# EAGLE design badge2 (EAGLE 9.3.1)
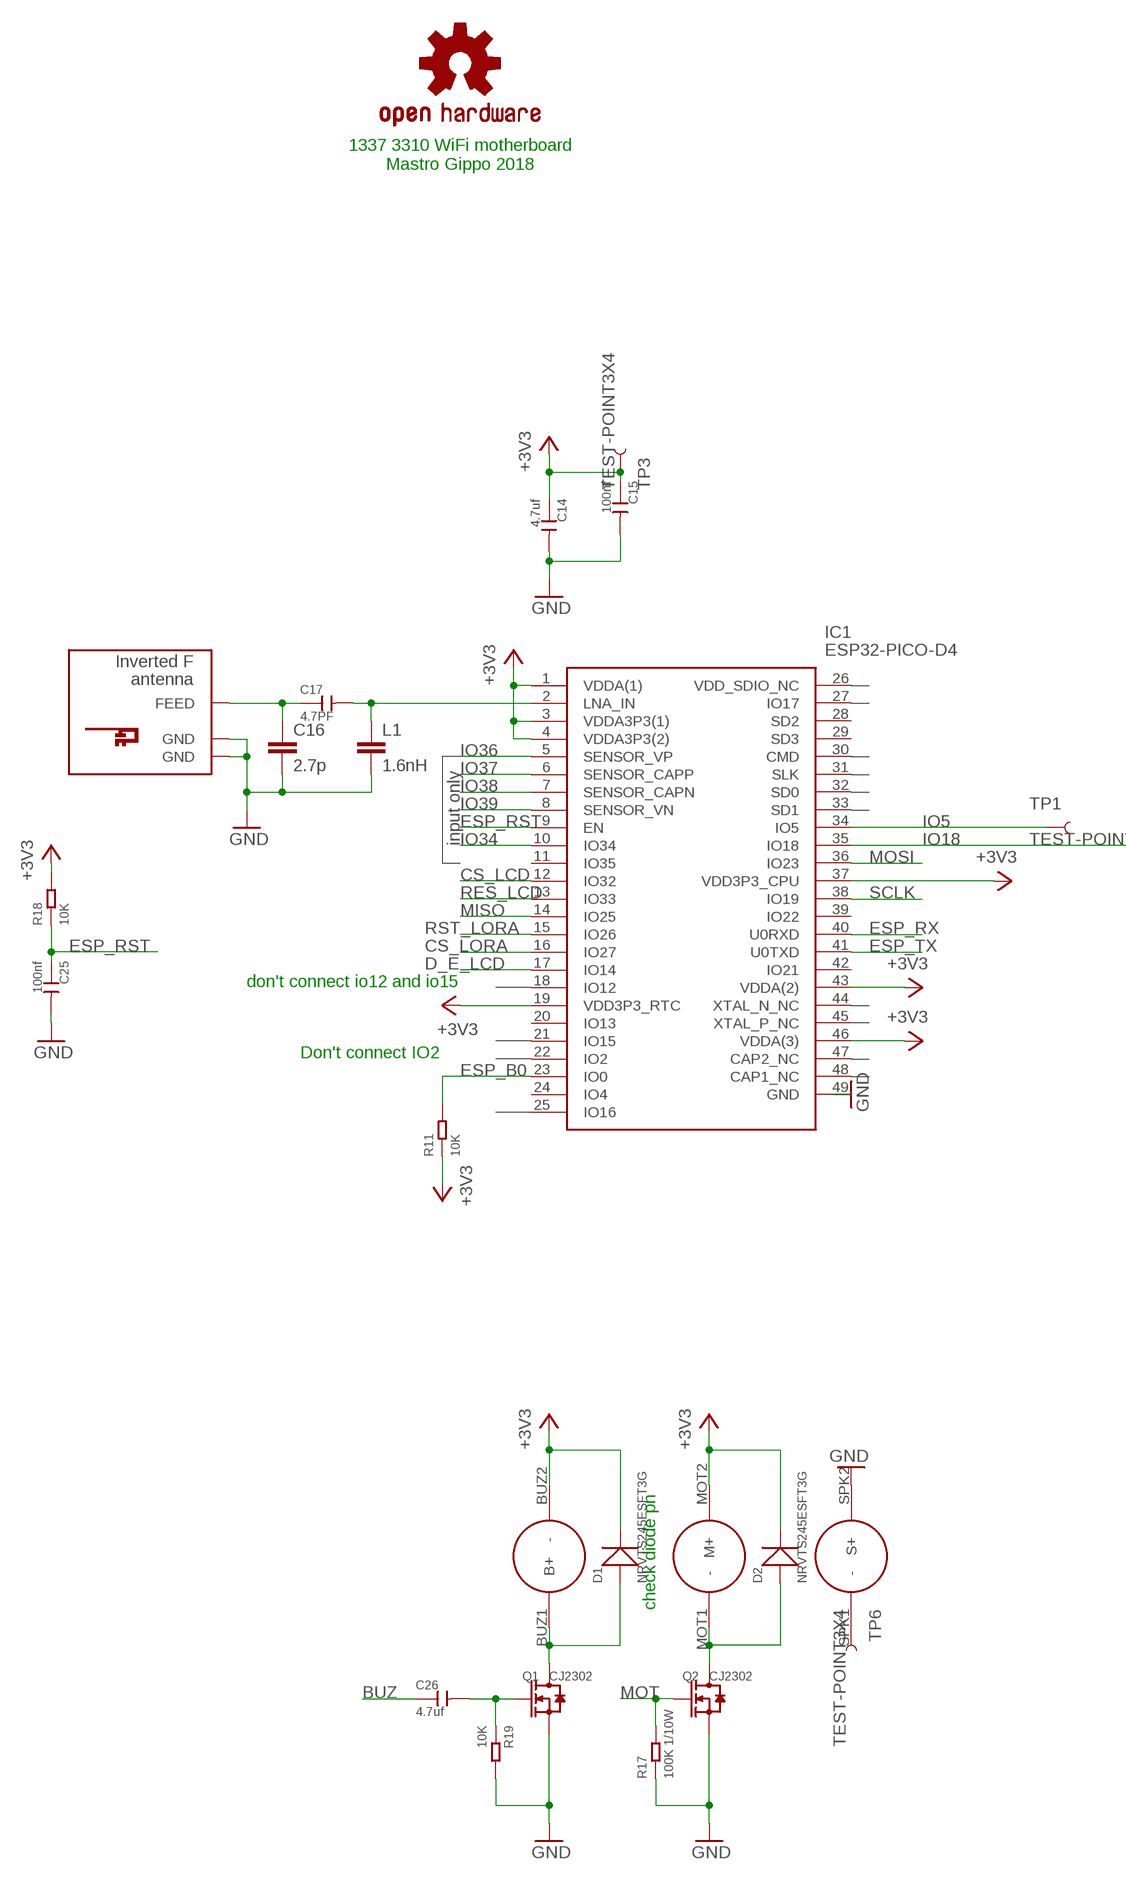
[diagram p0: schematic, sheet 1, part 1 of 2]
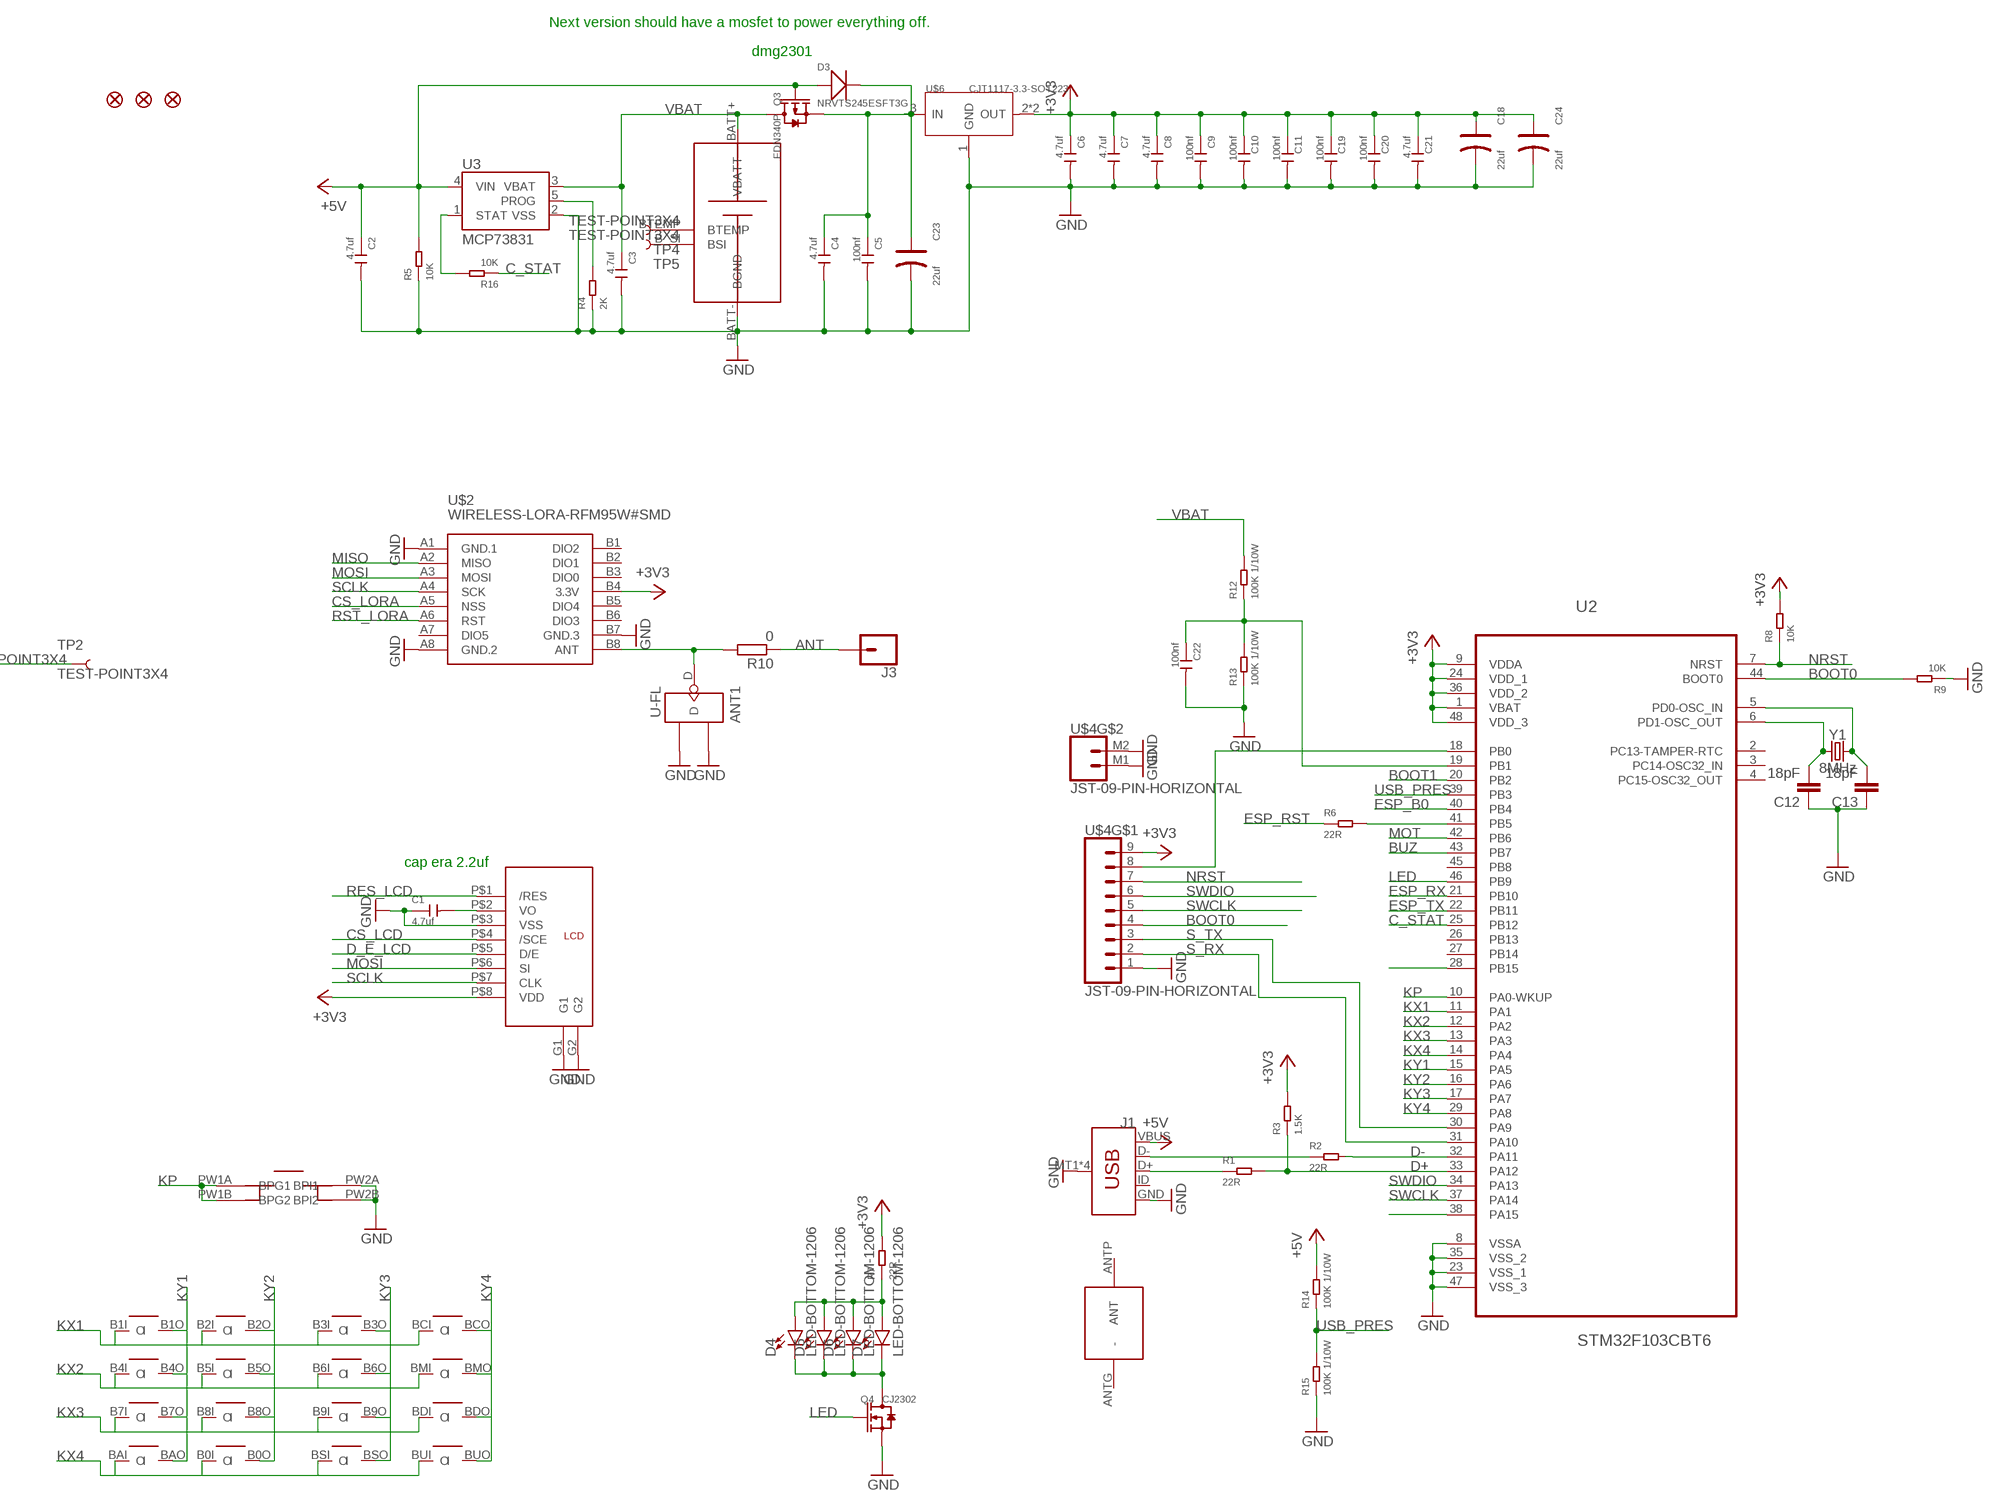
[diagram p1: schematic, sheet 1, part 2 of 2]

## Parts
ANT1  U-FL  ANTENNA-CONN-U-FL(3P)  [U-FL3P-SMD-2.6X2.6X1.0MM]
C1  4.7uf  CERAMIC-4.7UF-10V-10%-X5R(0603)  [C0603]
C2  4.7uf  CERAMIC-4.7UF-10V-10%-X5R(0603)  [C0603]
C3  4.7uf  CERAMIC-4.7UF-10V-10%-X5R(0603)  [C0603]
C4  4.7uf  CERAMIC-4.7UF-10V-10%-X5R(0603)  [C0603]
C5  100nf  CERAMIC-100NF-50V-10%-X7R(0603)  [C0603]
C6  4.7uf  CERAMIC-4.7UF-10V-10%-X5R(0603)  [C0603]
C7  4.7uf  CERAMIC-4.7UF-10V-10%-X5R(0603)  [C0603]
C8  4.7uf  CERAMIC-4.7UF-10V-10%-X5R(0603)  [C0603]
C9  100nf  CERAMIC-100NF-50V-10%-X7R(0603)  [C0603]
C10  100nf  CERAMIC-100NF-50V-10%-X7R(0603)  [C0603]
C11  100nf  CERAMIC-100NF-50V-10%-X7R(0603)  [C0603]
C12  18pF  18PF-0603-50V-5%  [0603]
C13  18pF  18PF-0603-50V-5%  [0603]
C14  4.7uf  CERAMIC-4.7UF-10V-10%-X5R(0603)  [C0603]
C15  100nf  CERAMIC-100NF-50V-10%-X7R(0603)  [C0603]
C16  2.7p  C-EUC0603  [C0603]
C17  4.7PF  CERAMIC-4.7PF-50V-0.25PF-NPO(0603)  [C0603]
C18  22uf  TANTALUM-SMD-22UF-16V(AVX-B)  [AVX-B]
C19  100nf  CERAMIC-100NF-50V-10%-X7R(0603)  [C0603]
C20  100nf  CERAMIC-100NF-50V-10%-X7R(0603)  [C0603]
C21  4.7uf  CERAMIC-4.7UF-10V-10%-X5R(0603)  [C0603]
C22  100nf  CERAMIC-100NF-50V-10%-X7R(0603)  [C0603]
C23  22uf  TANTALUM-SMD-22UF-16V(AVX-B)  [AVX-B]
C24  22uf  TANTALUM-SMD-22UF-16V(AVX-B)  [AVX-B]
C25  100nf  CERAMIC-100NF-50V-10%-X7R(0603)  [C0603]
C26  4.7uf  CERAMIC-4.7UF-10V-10%-X5R(0603)  [C0603]
D1  NRVTS245ESFT3G  SMD-DIODE-SCHOTTKY-20V-1A(SOD-123)  [SOD-123]
D2  NRVTS245ESFT3G  SMD-DIODE-SCHOTTKY-20V-1A(SOD-123)  [SOD-123]
D3  NRVTS245ESFT3G  SMD-DIODE-SCHOTTKY-20V-1A(SOD-123)  [SOD-123]
D4  LED-BOTTOM-1206  [LED-1206]
D5  LED-BOTTOM-1206  [LED-1206]
D6  LED-BOTTOM-1206  [LED-1206]
D7  LED-BOTTOM-1206  [LED-1206]
FID1  FIDUCIAL1.5X3  [FIDUCIAL-1.5X3]
FID2  FIDUCIAL1.5X3  [FIDUCIAL-1.5X3]
FID3  FIDUCIAL1.5X3  [FIDUCIAL-1.5X3]
IC1  ESP32-PICO-D4  [ESP32-PICO-D4_1]
J1  USB_MICRO-B_SMT  [USB-MICROB]
J3  CONN_01POGOPIN_HOLE_0.58  [1X01_POGOPIN_HOLE_0.58_DIA]
L1  1.6nH  C-EUC0603K  [C0603K]
LOGO1  OSHW-LOGOM  [OSHW-LOGO-M]
Q1  CJ2302  SMD-MOSFET-N-CH-20V-2.1A-CJ2302(SOT-23)  [SOT-23]
Q2  CJ2302  SMD-MOSFET-N-CH-20V-2.1A-CJ2302(SOT-23)  [SOT-23]
Q3  FDN340P  SMD-MOSFET-P-CH-20V-2A-FDN340P(SOT-23)  [SOT-23]
Q4  CJ2302  SMD-MOSFET-N-CH-20V-2.1A-CJ2302(SOT-23)  [SOT-23]
R1  22R  SMD-RES-22R-5%-1/10W(0603)  [R0603]
R2  22R  SMD-RES-22R-5%-1/10W(0603)  [R0603]
R3  1.5K  SMD-RES-1.5K-1%-1/10W(0603)  [R0603]
R4  2K  SMD-RES-2K-1%-1/10W(0603)  [R0603]
R5  10K  SMD-RES-10K-1%-1/10W(0603)  [R0603]
R6  22R  SMD-RES-22R-5%-1/10W(0603)  [R0603]
R7  22R  SMD-RES-22R-5%-1/10W(0603)  [R0603]
R8  10K  SMD-RES-10K-1%-1/10W(0603)  [R0603]
R9  10K  SMD-RES-10K-1%-1/10W(0603)  [R0603]
R10  0  R-EU_R0603  [R0603]
R11  10K  SMD-RES-10K-1%-1/10W(0603)  [R0603]
R12  100K 1/10W  SMD-RES-100K-5%-1/10W(0603)  [R0603]
R13  100K 1/10W  SMD-RES-100K-5%-1/10W(0603)  [R0603]
R14  100K 1/10W  SMD-RES-100K-5%-1/10W(0603)  [R0603]
R15  100K 1/10W  SMD-RES-100K-5%-1/10W(0603)  [R0603]
R16  10K  SMD-RES-10K-1%-1/10W(0603)  [R0603]
R17  100K 1/10W  SMD-RES-100K-5%-1/10W(0603)  [R0603]
R18  10K  SMD-RES-10K-1%-1/10W(0603)  [R0603]
R19  10K  SMD-RES-10K-1%-1/10W(0603)  [R0603]
TP1  TEST-POINT3X4  [PAD.03X.04]
TP2  TEST-POINT3X4  [PAD.03X.04]
TP3  TEST-POINT3X4  [PAD.03X.04]
TP4  TEST-POINT3X4  [PAD.03X.04]
TP5  TEST-POINT3X4  [PAD.03X.04]
TP6  TEST-POINT3X4  [PAD.03X.04]
U2  STM32F103CBT6  [QFP50P900X900X160-48N]
U3  MCP73831  [SOT23-5]
U$1  3310PANEL  [3310LCD]
U$2  WIRELESS-LORA-RFM95W#SMD  [WIRELESS-LORA-RFM95W#SMD]
U$3  INVERTED_F_ANTENNA+2  [DN007+2]
U$4  JST-09-PIN-HORIZONTAL  [JST-09-SMD-HORI-1.0MM]
U$6  CJT1117-3.3-SOT223  PMIC-CJT1117-3.3(SOT223)  [SOT-223]
Y1  8MHz  CRYSTAL-8MHZSMD-5X3.2  [CRYSTAL-SMD-5X3.2-4PAD]

## Nets
+3V3: C6.1 C7.1 C8.1 C9.1 C10.1 C11.1 C14.1 C15.1 C18.+ C19.1 C20.1 C21.1 C24.+ D1.- D2.- IC1.1(VDDA(1)) IC1.3(VDDA3P3(1)) IC1.4(VDDA3P3(2)) IC1.19(VDD3P3_RTC) IC1.37(VDD3P3_CPU) IC1.43(VDDA(2)) IC1.46(VDDA(3)) R3.2 R7.2 R8.2 R11.1 R18.2 TP3.P$1 U2.1(VBAT) U2.9(VDDA) U2.24(VDD_1) U2.36(VDD_2) U2.48(VDD_3) U$1.BUZ2(-) U$1.MOT2(M+) U$1.P$8(VDD) U$2.B4(3.3V) U$4.9 U$6.2(OUT) U$6.TER(OUT)
+5V: C2.1 D3.+ J1.VBUS Q3.1(G) R5.2 R14.2 U3.4(VIN)
ANT: J3.1 R10.1
BOOT0: R9.2 U2.44(BOOT0) U$4.4
BOOT1: U2.20(PB2)
BUZ: C26.1 U2.43(PB7)
C_STAT: R16.1 U2.25(PB12)
CS_LCD: IC1.12(IO32) U$1.P$4(/SCE)
CS_LORA: IC1.16(IO27) U$2.A5(NSS)
D+: R1.2 R3.1 U2.33(PA12)
D-: R2.2 U2.32(PA11)
D_E_LCD: IC1.17(IO14) U$1.P$5(D/E)
ESP_B0: IC1.23(IO0) R11.2 U2.40(PB4)
ESP_RST: C25.1 IC1.9(EN) R6.1 R18.1
ESP_RX: IC1.40(U0RXD) U2.21(PB10)
ESP_TX: IC1.41(U0TXD) U2.22(PB11)
GND: ANT1.GND1 ANT1.GND2 C1.1 C2.2 C3.2 C4.2 C5.2 C6.2 C7.2 C8.2 C9.2 C10.2 C11.2 C12.1 C13.1 C14.2 C15.2 C16.2 C18.- C19.2 C20.2 C21.2 C22.2 C23.- C24.- C25.2 IC1.49(GND) J1.GND J1.MT1(SHIELD) J1.MT2(SHIELD) J1.P$1(SHIELD) J1.P$2(SHIELD) L1.2 Q1.2(S) Q2.2(S) Q4.2(S) R4.1 R5.1 R9.1 R13.1 R15.1 R17.1 R19.2 U2.8(VSSA) U2.23(VSS_1) U2.35(VSS_2) U2.47(VSS_3) U3.2(VSS) U$1.BATT-(BGND) U$1.G1 U$1.G2 U$1.P$3(VSS) U$1.PW2A(BPI1) U$1.PW2B(BPI2) U$1.SPK2(S+) U$2.A1(GND.1) U$2.A8(GND.2) U$2.B7(GND.3) U$3.GND U$3.GND@1(GND) U$4.1 U$4.M1 U$4.M2 U$6.1(GND)
IO5: IC1.34(IO5) TP1.P$1
IO18: IC1.35(IO18) TP2.P$1
IO34: IC1.10(IO34)
IO36: IC1.5(SENSOR_VP)
IO37: IC1.6(SENSOR_CAPP)
IO38: IC1.7(SENSOR_CAPN)
IO39: IC1.8(SENSOR_VN)
KP: U2.10(PA0-WKUP) U$1.PW1A(BPG1) U$1.PW1B(BPG2)
KX1: U2.11(PA1) U$1.B1I(I) U$1.B2I(I) U$1.B3I(I) U$1.BCI(I)
KX2: U2.12(PA2) U$1.B4I(I) U$1.B5I(I) U$1.B6I(I) U$1.BMI(I)
KX3: U2.13(PA3) U$1.B7I(I) U$1.B8I(I) U$1.B9I(I) U$1.BDI(I)
KX4: U2.14(PA4) U$1.B0I(I) U$1.BAI(I) U$1.BSI(I) U$1.BUI(I)
KY1: U2.15(PA5) U$1.B1O(O) U$1.B4O(O) U$1.B7O(O) U$1.BAO(O)
KY2: U2.16(PA6) U$1.B0O(O) U$1.B2O(O) U$1.B5O(O) U$1.B8O(O)
KY3: U2.17(PA7) U$1.B3O(O) U$1.B6O(O) U$1.B9O(O) U$1.BSO(O)
KY4: U2.29(PA8) U$1.BCO(O) U$1.BDO(O) U$1.BMO(O) U$1.BUO(O)
LED: Q4.1(G) U2.46(PB9)
MISO: IC1.14(IO25) U$2.A2(MISO)
MOSI: IC1.36(IO23) U$1.P$6(SI) U$2.A3(MOSI)
MOT: Q2.1(G) R17.2 U2.42(PB6)
N$1: C1.2 U$1.P$2(VO)
N$2: C16.1 C17.1 U$3.FEED
N$3: C17.2 IC1.2(LNA_IN) L1.1
N$4: ANT1.D R10.2 U$2.B8(ANT)
N$5: J1.D+ R1.1
N$6: J1.D- R2.1
N$7: R16.2 U3.1(STAT)
N$8: C26.2 Q1.1(G) R19.1
N$9: D1.+ Q1.3(D) U$1.BUZ1(B+)
N$10: C13.2 U2.5(PD0-OSC_IN) Y1.3
N$11: TP4.P$1 U$1.BTEMP
N$12: D2.+ Q2.3(D) U$1.MOT1(-)
N$13: R4.2 U3.5(PROG)
N$14: C4.1 C5.1 C23.+ D3.- Q3.2(S) U$6.3(IN)
N$15: C12.2 U2.6(PD1-OSC_OUT) Y1.1
N$16: U2.18(PB0) U$4.8
N$17: TP6.P$1 U$1.SPK1(-)
N$19: R6.2 U2.41(PB5)
N$20: U2.28(PB15)
N$21: TP5.P$1 U$1.B_SI(BSI)
N$22: U2.38(PA15)
N$23: D4.C D5.C D6.C D7.C Q4.3(D)
N$24: D4.A D5.A D6.A D7.A R7.1
N$26: C22.1 R12.1 R13.2 U2.19(PB1)
NRST: R8.1 U2.7(NRST) U$4.7
RES_LCD: IC1.13(IO33) U$1.P$1(/RES)
RST_LORA: IC1.15(IO26) U$2.A6(RST)
S_RX: U2.31(PA10) U$4.2
S_TX: U2.30(PA9) U$4.3
SCLK: IC1.38(IO19) U$1.P$7(CLK) U$2.A4(SCK)
SWCLK: U2.37(PA14) U$4.5
SWDIO: U2.34(PA13) U$4.6
USB_PRES: R14.1 R15.2 U2.39(PB3)
VBAT: C3.1 Q3.3(D) R12.2 U3.3(VBAT) U$1.BATT+(VBATT)
Unconnected: IC1.11(IO35) IC1.18(IO12) IC1.20(IO13) IC1.21(IO15) IC1.22(IO2) IC1.24(IO4) IC1.25(IO16) IC1.26(VDD_SDIO_NC) IC1.27(IO17) IC1.28(SD2) IC1.29(SD3) IC1.30(CMD) IC1.31(SLK) IC1.32(SD0) IC1.33(SD1) IC1.39(IO22) IC1.42(IO21) IC1.44(XTAL_N_NC) IC1.45(XTAL_P_NC) IC1.47(CAP2_NC) IC1.48(CAP1_NC) J1.ID U2.2(PC13-TAMPER-RTC) U2.3(PC14-OSC32_IN) U2.4(PC15-OSC32_OUT) U2.26(PB13) U2.27(PB14) U2.45(PB8) U$1.ANTG(-) U$1.ANTP(ANT) U$2.A7(DIO5) U$2.B1(DIO2) U$2.B2(DIO1) U$2.B3(DIO0) U$2.B5(DIO4) U$2.B6(DIO3)

## Notes on the sheet
- Next version should have a mosfet to power everything off.
- dmg2301
- 1337 3310 WiFi motherboard
  Mastro Gippo 2018
- input only
- don't connect io12 and io15
- Don't connect IO2
- cap era 2.2uf
- check diode pn

## Library data of the parts
ANT1 = Seeed-Connector:ANTENNA-CONN-U-FL(3P): 320110048
C1-C4 C6-C8 C14 C21 C26 = Seeed-Capacitor:CERAMIC-4.7UF-10V-10%-X5R(0603): 302010111; MPN: CC0603KRX5R6BB475
C5 C9-C11 C15 C19 C20 C22 C25 = Seeed-Capacitor:CERAMIC-100NF-50V-10%-X7R(0603): 302010138; MPN: CC0603KRX7R9BB104
C12 C13 = SparkFun-Capacitors:18PF: 18pF ceramic capacitors A capacitor is a passive two-terminal electrical component used to store electrical energy temporarily in an electric field.; PROD_ID: CAP-08267
C16 L1 = rcl:C-EU: CAPACITOR, European symbol; SPICEPREFIX: C
C17 = Seeed-Capacitor:CERAMIC-4.7PF-50V-0.25PF-NPO(0603): 302010091; MPN: CC0603CRNPO9BN4R7
C18 C23 C24 = Seeed-Capacitor:TANTALUM-SMD-22UF-16V(AVX-B): 302020013; MPN: TAJB226*016#NJ
D1-D3 = Seeed-Diode:SMD-DIODE-SCHOTTKY-20V-1A(SOD-123): 304020034; MPN: B5819W; VALUE: 20V-1A
D4-D7 = mastrogippo:LED-BOTTOM-1206
FID1-FID3 = SparkFun-Retired:FIDUCIAL: Fiducial Alignment Points Various fiducial points for machine vision alignment.
IC1 = ESP32-PICO-D4_MG:ESP32-PICO-D4: ESP32-PICO-D4 module Source: Datasheet <http://www.espressif.com/sites/default/files/documentation/esp32-pico-d4_datasheet_en.pdf>; ARROW_PART_NUMBER: ESP32-PICO-D4; DESCRIPTION: ESP32-PICO-D4 module; HEIGHT: mm; MANUFACTURER_NAME: Espressif; MANUFACTURER_PART_NUMBER: ESP32-PICO-D4
J1 = SparkFun-Connectors:USB_MICRO-B: USB Type Micro-B Connector Male/female and PTH/SMT variants SparkFun Products: SparkFun microB USB Breakout <https://www.sparkfun.com/products/12035> SparkFun USB microB Plug Breakout <https://www.sparkfun.com/products/10031> SparkFun ESP8266 Thing <https://www.sparkfun.com/products/13231>; PROD_ID: CONN-09505; SF_ID: PRT-08533
J3 = SparkFun-Connectors:CONN_01: Single connection point. Often used as Generic Header-pin footprint for 0.1 inch spaced/style header connections On any of the 0.1 inch spaced packages, you can populate with these: Break Away Headers - Straight <https://www.sparkfun.com/products/116> (PRT-00116) Break Away Male Headers - Right Angle <https://www.sparkfun.com/products/553> (PRT-00553) Female Headers <https://www.sparkfun.com/products/115> (PRT-00115) Break Away Headers - Machine Pin <https://www.sparkfun.com/products/117> (PRT-00117) Break Away Female Headers - Swiss Machine Pin <https://www.sparkfun.com/products/743> (PRT-00743) This device is also useful as a general connection point to wire up your design to another part of your project. Our various solder wires solder well into these plated through hole pads. Hook-Up Wire - Assortment (Stranded, 22 AWG) <https://www.sparkfun.com/products/11375> (PRT-11375) Hook-Up Wire - Assortment (Solid Core, 22 AWG) <https://www.sparkfun.com/products/11367> (PRT-11367) View the entire wire category on our website here <https://www.sparkfun.com/categories/141> Special notes: SMTSO-256-ET is a "flush mount" nut for a 4-40 screw. We mostly use this on specialty testbeds; it is a nice way to connect hardware to your PCB at an adjustable hieght. Also note, the SNAP packages are for using a snappable style connector. We sell a baggie of snaps and they are also used on two LilyPad designs: Snap Assortment - 30 pack (male and female) <https://www.sparkfun.com/products/11347> (DEV-11347) LilyPad Arduino SimpleSnap <https://www.sparkfun.com/products/10941> (DEV-10941) LilyPad SimpleSnap Protoboard <https://www.sparkfun.com/products/10940> (DEV-10940)
LOGO1 = SparkFun-Aesthetics:OSHW-LOGO: Open-Source Hardware (OSHW) Logo This logo indicates the piece of hardware it is found on incorporates a OSHW license and/or adheres to the definition of open source hardware found here: http://freedomdefined.org/OSHW
Q1 Q2 Q4 = Seeed-Transistor:SMD-MOSFET-N-CH-20V-2.1A-CJ2302(SOT-23): 305030015; MPN: CJ2302
Q3 = Seeed-Transistor:SMD-MOSFET-P-CH-20V-2A-FDN340P(SOT-23): 305030026; MPN: FDN340P
R1 R2 R6 R7 = Seeed-Resistor:SMD-RES-22R-5%-1/10W(0603): 301010289; MPN: RC0603JR-0722RL
R3 = Seeed-Resistor:SMD-RES-1.5K-1%-1/10W(0603): 301010189; MPN: RC0603FR-071K5L
R4 = Seeed-Resistor:SMD-RES-2K-1%-1/10W(0603): 301010221; MPN: RC0603FR-072KL
R5 R8 R9 R11 R16 R18 R19 = Seeed-Resistor:SMD-RES-10K-1%-1/10W(0603): 301010299; MPN: RC0603FR-0710KL
R10 = rcl:R-EU_: RESISTOR, European symbol; SPICEPREFIX: R
R12-R15 R17 = Seeed-Resistor:SMD-RES-100K-5%-1/10W(0603): 301010089; MPN: RC0603JR-07100KL
TP1-TP6 = SparkFun-Connectors:TEST-POINT: SparkFun Test Points Bare copper test points for troubleshooting or In-Circuit-Testing. These are used by our Production team for verifying production board runs using pogo-pins on test beds. SparkFun Products: SparkFun LSM9DS1 Breakout <https://www.sparkfun.com/products/13284> SparkFun PSOC <https://www.sparkfun.com/products/13714> SparkFun Load Cell Amplifier <https://www.sparkfun.com/products/13879>
U2 = ST Microelctronics_By_element14_Batch_1:STM32F103CBT6: Medium-density performance line ARM-based 32-bit MCU; MPN: STM32F103CBT6; OC_FARNELL: 1606327; OC_NEWARK: 11N8296; PACKAGE: QFP-48; SUPPLIER: STMICROELECTRONICS
U3 = SparkFun-IC-Power:MCP73831: MCP73831T Li-Ion, Li-Pol Controller Miniature single cell, fully integrated Li-Ion, Li-polymer charge management controller Datasheet <http://ww1.microchip.com/downloads/en/DeviceDoc/20001984g.pdf> SparkFun Products: SparkFun ESP32 Thing <https://www.sparkfun.com/products/13907> SparkFun 9DoF Razor IMU M0 <https://www.sparkfun.com/products/14001>; PROD_ID: IC-09995
U$1 = mastrogippo:3310PANEL
U$2 = diy-modules:WIRELESS-LORA-RFM95W: 868/915 MHz LoRa Radio Transceiver Module based on SX1276 chip Click here to find device on ebay.com <http://www.ebay.com/sch/RFM95W+transceiver>
U$3 = antenna:INVERTED_F_ANTENNA: 2.4GHz Inverted F Antenna Based on TI Design Note DN007
U$4 = SparkFun-Connectors:JST-09-PIN-HORIZONTAL
U$6 = Seeed-IC:PMIC-CJT1117-3.3(SOT223): 310030097; MPN: CJT1117-3.3
Y1 = SparkFun-Clocks:CRYSTAL-8MHZ: 8MHz Crystal Datasheet Example <http://www.futureelectronics.com/en/technologies/electromechanical/timing-devices/crystals/Pages/6008189-ABM3B-8.000MHZ-B2-T.aspx?IM=0> Frequency: 8MHz Frequency Tolerance: ±20ppm Load Capacitance: 18pF SparkFun Products: Pro Micro -3.3V/8MHz <https://www.sparkfun.com/products/12587> WAV Trigger <https://www.sparkfun.com/products/13660>; PROD_ID: XTAL-09431

## Board
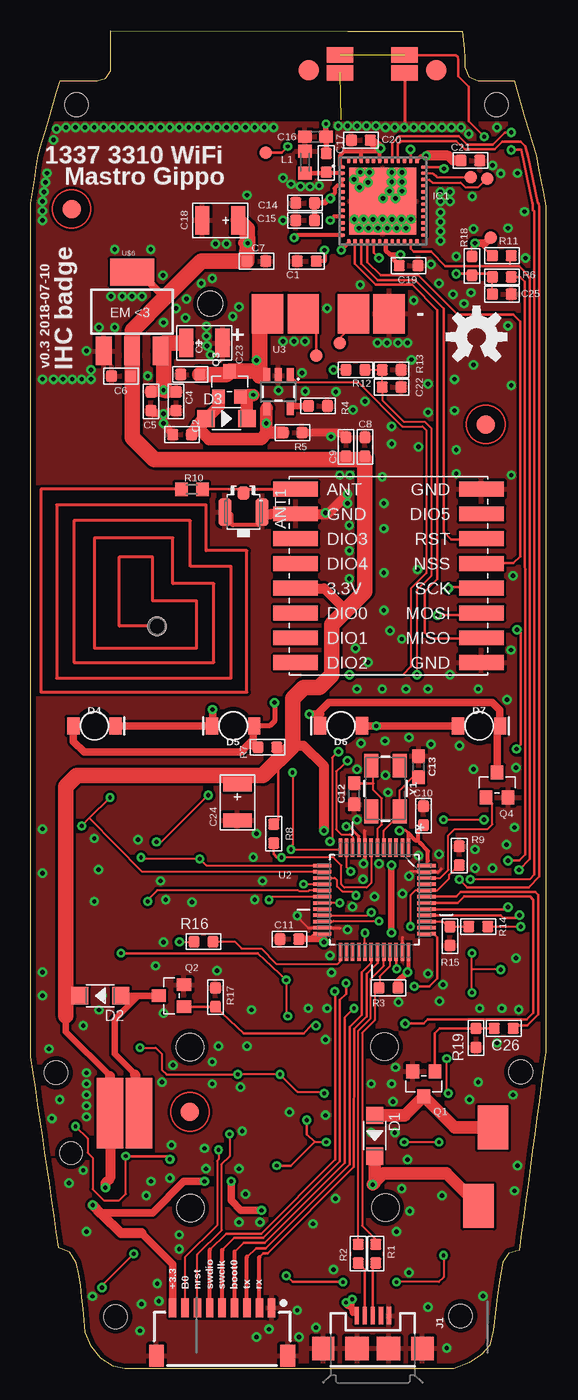
[diagram p2: board, top side]
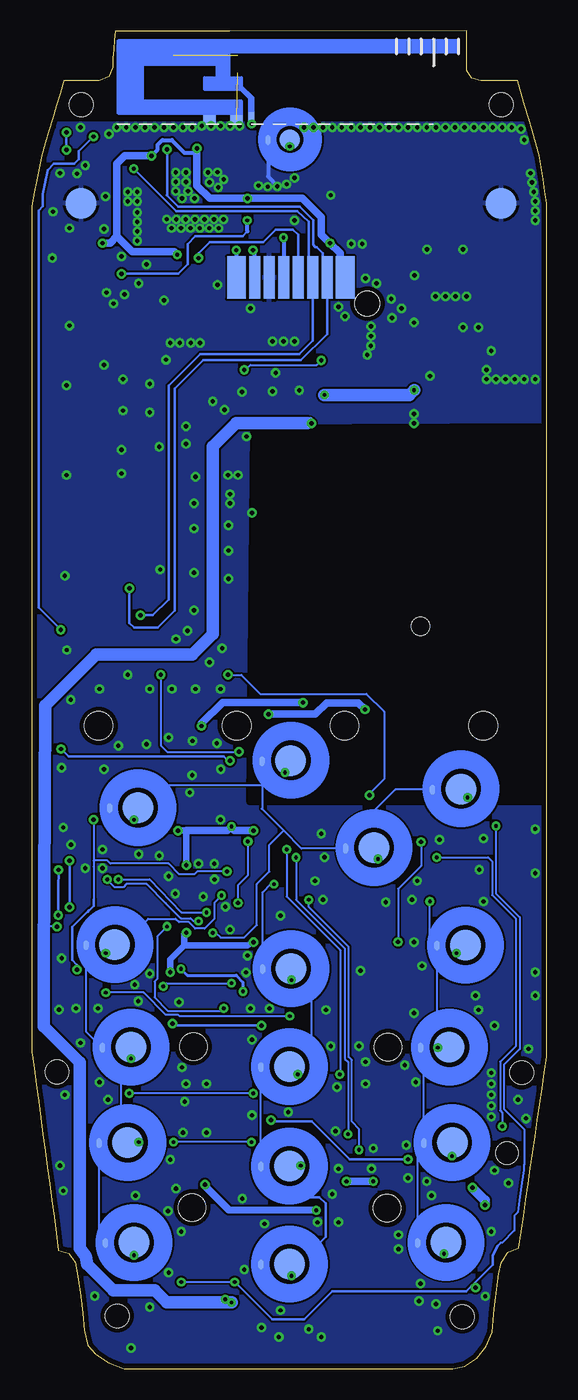
[diagram p3: board, bottom side, seen from below]

Size 41.55 x 108 mm. Coordinates in mm from the lower left corner, seen from the top.
Copper layers (1*16): Top 0.035mm / dielectric 1.5mm / Bottom 0.035mm
Design rules "default *": minimum track width 6mil, minimum drill 0.3mm, track to track 6mil, track to pad 6mil, pad to pad 6mil, via to via 6mil, smd to smd 6mil, copper to edge 15mil, drill to drill 6mil, minimum pad ring 10mil, minimum via ring 8mil, stop-mask expansion 4mil, vias tented up to drill 0mil, thermal gap 10mil

### Footprints (pad centres in the part's own frame; a part is rotated, then mirrored left to right if it is on the bottom)
U-FL3P-SMD-2.6X2.6X1.0MM = smd 1.05 x 1: D -1.524,0 | smd 2.2 x 1.05: GND1 0,1.5; GND2 0,-1.5
C0603 = smd 0.889 x 0.889: 1 0,0.762; 2 0,-0.762
0603 = smd 1.1 x 1: 1 -0.85,0; 2 0.85,0
C0603' = smd 1.1 x 1: 1 -0.85,0; 2 0.85,0
AVX-B = smd 1.143 x 2.286: + -1.46,0; - 1.46,0
SOD-123 = smd 1.397 x 1.397: + -1.651,0; - 1.651,0
LED-1206 = smd 1 x 1.4: A -1.7,0; C 1.7,0
FIDUCIAL-1.5X3 = smd 1.5 x 1.5: 1 0,0
ESP32-PICO-D4_1 = smd 0.475 x 0.3: 1 -3.3,2.75; 2 -3.3,2.25; 3 -3.3,1.75; 4 -3.3,1.25; 5 -3.3,0.75; 6 -3.3,0.25; 7 -3.3,-0.25; 8 -3.3,-0.75; 9 -3.3,-1.25; 10 -3.3,-1.75; 11 -3.3,-2.25; 12 -3.3,-2.75; 25 3.3,-2.75; 26 3.3,-2.25; 27 3.3,-1.75; 28 3.3,-1.25; 29 3.3,-0.75; 30 3.3,-0.25; 31 3.3,0.25; 32 3.3,0.75; 33 3.3,1.25; 34 3.3,1.75; 35 3.3,2.25; 36 3.3,2.75 | smd 0.3 x 0.475: 13 -2.75,-3.3; 14 -2.25,-3.3; 15 -1.75,-3.3; 16 -1.25,-3.3; 17 -0.75,-3.3; 18 -0.25,-3.3; 19 0.25,-3.3; 20 0.75,-3.3; 21 1.25,-3.3; 22 1.75,-3.3; 23 2.25,-3.3; 24 2.75,-3.3; 37 2.75,3.3; 38 2.25,3.3; 39 1.75,3.3; 40 1.25,3.3; 41 0.75,3.3; 42 0.25,3.3; 43 -0.25,3.3; 44 -0.75,3.3; 45 -1.25,3.3; 46 -1.75,3.3; 47 -2.25,3.3; 48 -2.75,3.3 | smd 5.4 x 5.4: 49 -0.006,0.013
USB-MICROB = smd 1.4 x 0.35: D+ -2.65,0; D- -2.65,-0.65; GND -2.65,1.3; ID -2.65,0.65; VBUS -2.65,-1.3 | smd 1.9 x 1.8: MT1 0,-4; MT2 0,4 | smd 1.9 x 1.9: P$1 0,-1.27; P$2 0,1.27
1X01_POGOPIN_HOLE_0.58_DIA = drill 0.9 pad 0.813: 1 0,0 | hole 1.473: 0,0
C0603K = smd 1.05 x 1.08: 1 -0.875,0; 2 0.875,0
SOT-23 = smd 1.016 x 1.143: 1 -0.889,-1.016; 2 0.889,-1.016; 3 0,1.016
R0603 = smd 0.889 x 0.889: 1 0,0.762; 2 0,-0.762
R0603' = smd 1 x 1.1: 1 -0.85,0; 2 0.85,0
PAD.03X.04 = smd 1.016 x 1.016: P$1 0,0
QFP50P900X900X160-48N = smd 1.473 x 0.279: 1 -4.216,2.743; 2 -4.216,2.261; 3 -4.216,1.753; 4 -4.216,1.245; 5 -4.216,0.762; 6 -4.216,0.254; 7 -4.216,-0.254; 8 -4.216,-0.762; 9 -4.216,-1.245; 10 -4.216,-1.753; 11 -4.216,-2.261; 12 -4.216,-2.743; 25 4.216,-2.743; 26 4.216,-2.261; 27 4.216,-1.753; 28 4.216,-1.245; 29 4.216,-0.762; 30 4.216,-0.254; 31 4.216,0.254; 32 4.216,0.762; 33 4.216,1.245; 34 4.216,1.753; 35 4.216,2.261; 36 4.216,2.743 | smd 0.279 x 1.473: 13 -2.743,-4.216; 14 -2.261,-4.216; 15 -1.753,-4.216; 16 -1.245,-4.216; 17 -0.762,-4.216; 18 -0.254,-4.216; 19 0.254,-4.216; 20 0.762,-4.216; 21 1.245,-4.216; 22 1.753,-4.216; 23 2.261,-4.216; 24 2.743,-4.216; 37 2.743,4.216; 38 2.261,4.216; 39 1.753,4.216; 40 1.245,4.216; 41 0.762,4.216; 42 0.254,4.216; 43 -0.254,4.216; 44 -0.762,4.216; 45 -1.245,4.216; 46 -1.753,4.216; 47 -2.261,4.216; 48 -2.743,4.216
SOT23-5 = smd 0.55 x 1.2: 1 -0.95,-1.3; 2 0,-1.3; 3 0.95,-1.3; 4 0.95,1.3; 5 -0.95,1.3
3310LCD = smd 1.651 x 1.651 bottom: ANTG 8.839,104.826; ANTP 19.126,104.826 | smd 2.5 x 2.5: B0I 20.79,8.442; B1I 6.69,34.242; B2I 20.94,32.292; B3I 34.99,34.192; B4I 7.99,25.942; B5I 20.79,24.392; B6I 33.69,25.942; B7I 7.74,18.242; B8I 20.79,16.342; B9I 33.94,18.242; BAI 8.24,10.192; BCI 8.59,45.292; BDI 27.64,42.042; BMI 20.89,49.092; BSI 33.44,10.192; BUI 34.64,46.792; G1 3.99,94.092; G2 37.89,94.092 | smd 0.406 x 0.813: B0O 18.49,8.392; B1O 4.39,34.192; B2O 18.64,32.242; B3O 32.69,34.142; B4O 5.69,25.892; B5O 18.49,24.342; B6O 31.39,25.892; B7O 5.44,18.192; B8O 18.49,16.292; B9O 31.64,18.192; BAO 5.94,10.142; BCO 6.29,45.242; BDO 25.34,41.992; BMO 18.59,49.042; BSO 31.14,10.142; BUO 32.34,46.742; SPK2 19.066,99.191 | smd 2.54 x 3.175 bottom: B_SI 19.583,85.166; BATT+ 22.454,85.166; BATT- 12.649,85.166; BTEMP 15.519,85.166 | smd 2.489 x 3.556 bottom: BUZ1 4.267,19.456; BUZ2 5.436,13.132 | smd 2.134 x 5.715 bottom: MOT1 32.842,20.625; MOT2 35.179,20.625 | smd 1.5 x 3.429: P$1 16.524,88.092; P$8 25.302,88.092 | smd 0.889 x 3.429: P$2 17.992,88.092; P$3 19.16,88.092; P$4 20.329,88.092; P$5 21.497,88.092; P$6 22.666,88.092; P$7 23.834,88.092 | smd 2.15 x 1.25 bottom: PW1A 11.409,106.061; PW1B 16.609,106.061; PW2A 11.409,104.615; PW2B 16.609,104.615 | smd 1.651 x 1.651: SPK1 20.828,99.238 | hole 1.905: 37.885,102.041; 3.985,102.041; 34.735,4.191; 6.885,4.241; 2.035,23.941; 39.535,23.891 | hole 2: 27.09,85.992 | hole 2.3: 5.39,51.892; 16.54,51.892; 25.24,51.892; 36.44,51.892 | hole 1.8: 38.34,17.392 | hole 2.2: 13.04,25.992; 28.74,25.942; 28.69,12.942; 12.94,12.992
WIRELESS-LORA-RFM95W#SMD = smd 3.6 x 1.2: A1 -7.5,7; A2 -7.5,5; A3 -7.5,3; A4 -7.5,1; A5 -7.5,-1; A6 -7.5,-3; A7 -7.5,-5; A8 -7.5,-7; B1 7.5,7; B2 7.5,5; B3 7.5,3; B4 7.5,1; B5 7.5,-1; B6 7.5,-3; B7 7.5,-5; B8 7.5,-7
DN007+2 = smd 0.46 x 1: FEED 2.22,-2.8 | smd 1.01 x 0.74: GND -1.16,-2.93; GND@1 1.035,-2.93
JST-09-SMD-HORI-1.0MM = smd 0.6 x 1.55: 1 -5.81,-4.775; 2 -4.81,-4.775; 3 -3.81,-4.775; 4 -2.81,-4.775; 5 -1.81,-4.775; 6 -0.81,-4.775; 7 0.19,-4.775; 8 1.19,-4.775; 9 2.19,-4.775 | smd 1.2 x 1.8: M1 -7.11,-0.9; M2 3.49,-0.9
SOT-223 = smd 1.27 x 2.286: 1 -2.286,-3.175; 2 0,-3.175; 3 2.286,-3.175 | smd 3.556 x 2.159: TER 0,3.175
CRYSTAL-SMD-5X3.2-4PAD = smd 1.9 x 1.1: 1 -1.85,-1.15; 2 1.85,-1.15; 3 1.85,1.15; 4 -1.85,1.15

### Placement (x,y rotation side)
ANT1  17.15,69.17 270 top
C1  22.26,89.41 90 top
C2  12.2,75.41 270 top
C3  12.86,80.27 270 top
C4  11.72,78.11 0 top
C5  9.68,78.11 0 top
C6  7.27,80.14 270 top
C7  18.19,89.41 90 top
C8  26.96,74.42 180 top
C9  25.43,74.42 180 top
C10  31.67,44.63 180 top
C11  20.86,34.67 270 top
C12  26.09,46.41 90 top
C13  31.29,48.6 270 top
C14  22.13,94.11 270 top
C15  22.13,92.71 270 top
C16  2.7p  [C0603']  22.97,99.47 180 top
C17  23.83,97.36 0 top
C18  15.27,92.71 180 top
C19  30.49,89.06 90 top
C20  26.63,99.19 270 top
C21  35.47,97.54 90 top
C22  29.12,79.25 90 top
C23  14,82.81 0 top
C24  16.67,45.72 270 top
C25  38.01,86.74 90 top
C26  38.16,27.46 270 top
D1  27.74,18.8 270 top
D2  5.59,30.1 180 top
D3  15.78,76.71 0 top
D4  5.12,51.88 0 top
D5  16.32,51.88 180 top
D6  25.02,51.89 180 top
D7  36.18,51.88 0 top
FID1  12.83,20.73 0 top
FID2  3.28,93.63 0 top
FID3  36.71,76.23 0 top
IC1  28.4,94.26 0 top
J1  27.59,1.63 270 top
J3  10.19,59.95 0 top
L1  22.13,97.41 90 top
LOGO1  35.97,83.29 0 top
Q1  31.71,22.99 180 top
Q2  11.34,30.1 90 top
Q3  16.03,79.5 0 top
Q4  37.62,47.12 0 top
R1  27.82,9.27 180 top
R2  26.42,9.27 180 top
R3  28.86,30.74 90 top
R4  23.17,77.73 270 top
R5  21.11,75.57 270 top
R6  38.01,88.14 90 top
R7  19.08,50.17 90 top
R8  19.59,43.18 180 top
R9  34.58,41.4 0 top
R10  0  [R0603']  12.99,70.99 0 top
R11  38.01,89.85 90 top
R12  26.19,80.65 270 top
R13  29.12,80.65 270 top
R14  36.1,35.69 90 top
R15  33.81,34.93 180 top
R16  13.93,34.47 270 top
R17  14.89,29.97 0 top
R18  35.59,89.03 180 top
R19  35.92,26.7 0 top
TP1  36.81,96.09 0 top
TP2  35.52,96.19 0 top
TP3  37.12,91.31 0 top
TP4  24.92,82.81 0 top
TP5  23.02,81.79 0 top
TP6  18.96,98.17 0 top
U2  27.72,37.85 270 top
U3  19.97,78.87 180 top
U$1  41.56,0 0 bottom
U$2  28.86,64.01 180 top
U$3  26.07,103.76 0 bottom
U$4  13.62,0.13 180 top
U$6  8.16,85.35 0 top
Y1  28.61,46.83 270 top

### Tracks (layer width: path | path; a pad name or v marks a point on that pad's centre or on a via)
+3V3  (via drill 0.3, 0.35)
  Top 0.152: 23.27,34.88 23.27,34.67 | R11.1 36.1,90.87 v35.85,90.87 35.59,90.62 R18.2 | U$2.B4 21,63.01 20.99,62.99 | 25.18,73.66 C9.1 26.96,73.41 | C8.1 26.92,73.41 | 26.99,73.24 26.96,72.39
  Top 0.2: 2.57,28.2 2.83,28.46
  Top 0.203: R8.2 19.97,44.29 19.97,49.57 R7.2 | 2.57,30.86 2.7,30.86 | U2.48 31.93,40.92 32.04,41.02
  Top 0.254: U2.1 30.46,43.23 30.26,43.44 v29.75,43.44 | 23.91,43.69 v23.65,43.44 | U2.9 26.47,42.97 25.68,43.76 v25.45,43.76
  Top 0.305: U2.24 23.32,34.93 | 23.32,34.93 22.76,34.93 | 23.32,34.93 23.27,34.88 | 32.04,41.02 32.04,41.78 31.4,42.42 31.22,42.62 | IC1.1 24.98,97.14 24.98,97.97 | U2.36 30.46,32.08 v30.38,32.01 | 31.22,42.62 31.07,42.62 30.46,43.23 | C10.1 31.22,43.42 31.22,42.62
  Top 0.33: IC1.3 IC1.4 24.73,95.51 24.52,95.3 24.52,94.9 24.34,94.72 24.29,94.72 | IC1.37 31.51,97.92 v31.91,97.92 | IC1.43 28.15,98.35 | 28.15,98.35 v28.23,98.53 | IC1.46 26.65,98.25 26.7,98.3 | 26.7,98.3 28.08,98.3 28.15,98.35 | 24.98,97.97 25.3,98.3 26.7,98.3
  Top 0.356: IC1.19 28.65,90.28 28.99,89.94 29.24,89.94 | C19.1 29.24,89.58 29.24,89.94 | 29.24,89.94 v29.82,89.94
  Top 0.406: 2.57,30.86 2.57,28.2
  Top 0.457: 24.29,94.72 24.11,94.54 23.7,94.13 C14.1 22.88,93.83 C15.1
  Top 0.508: v29.09,40.64 v29.09,35.21 | v30.38,32.01 29.58,31.2 R3.2 | C11.1 23.27,34.67 23.65,34.67 v23.65,34.42 | 6.38,23.62 2.83,27.18 2.83,28.46 | D2.- 2.83,30.1 | C24.+ 16.67,47.75 16.8,47.88
  Top 0.61: v24.16,94.49 24.11,94.54 | U$4.9 11.43,8.41 8.92,10.92 | TP3.P$1 36.67,90.87 v35.85,90.87 | v18.6,12.78 16.95,12.78 16.16,13.57 v16.16,15.11 | v14,15.11 12.35,15.11 9.81,12.57 5.75,12.57 5.68,12.51 | U$6.TER 8.72,88.52 10.74,86.5 10.84,86.5 | U$6.2 8.16,81.43 8.03,81.3 C6.1
  Top 0.813: 6.38,23.62 U$1.MOT2 6.38,15.37 6,14.99 v6,14.61 | 17.11,90.87 v17.49,90.87 | v23.65,43.44 23.65,48.64 22.01,50.29 21.11,50.29 20.31,49.9 19.97,49.57 | v4.98,13.21 5.68,12.51 7.27,10.92 8.92,10.92 | 20.99,62.99 23.65,62.99 25.37,61.28 25.37,61.15 | C21.1 34.07,97.54 33.69,97.92 v31.91,97.92 | v28.23,98.53 28.23,98.51 C20.1
  Top 1.016: D1.- 27.74,15.01 v27.59,14.86 28.48,15.75 33.51,15.75 U$1.BUZ2
  Top 1.27: U$6.2 8.16,83.82 10.84,86.5 13.75,89.41 C7.1 17.47,91.31 | 17.47,91.31 17.47,92.04 C18.+ | v17.49,90.87 17.49,91.29 17.47,91.31 | 8.16,81.43 8.16,75.19 9.94,73.41 26.92,73.41 26.96,73.41 26.96,72.39 26.96,62.74 25.37,61.15 24.29,60.07 24.29,56.01 23.27,54.99 22,54.99 21.11,54.1 21.11,50.29 18.71,47.88 16.8,47.88 3.71,47.88 2.83,46.99 2.83,30.1 2.83,28.46
  Bottom 0.33: v31.91,97.92 31.4,98.43 31.4,98.81 31.02,99.19 30.26,99.19 29.24,98.17 28.48,98.17 v28.23,98.53
  Bottom 0.508: v29.75,43.44 29.09,43.44 v29.09,40.64 | v23.65,34.42 24.16,34.16 29.24,34.16 | v29.09,35.21 29.24,35.05 29.24,34.16 | 29.24,34.16 30.38,33.02 v30.38,32.01
  Bottom 0.61: v31.91,97.92 34.07,97.92 34.7,97.28 34.7,91.44 | v28.23,98.53 28.23,95.51 27.21,94.49 v24.16,94.49 19.72,94.49 18.19,92.97 18.19,91.57 v17.49,90.87 16.67,90.04 16.67,88.5 U$1.P$8 | 34.7,91.44 33.43,90.17 30.05,90.17 v29.82,89.94 | 34.7,91.44 35.21,90.87 v35.85,90.87 | v27.59,14.86 27.59,14.73 25.66,12.8 v18.6,12.78 | v16.16,15.11 v14,15.11 | 23.78,43.46 v23.65,43.44 25.22,43.44 25.51,43.73 25.48,43.73 | 25.48,43.73 v25.45,43.76 | 25.48,43.73 25.77,43.44 29.09,43.44
  Bottom 0.813: v6,14.61 4.98,13.59 v4.98,13.21
+5V  (via drill 0.3, 0.35)
  Top 0.152: R14.2 v39.53,35.69
  Top 0.203: v25.43,5.34 25.86,4.86 25.93,4.83
  Top 0.305: 25.94,4.45 26.02,4.45 J1.VBUS | v18.99,76.33 18.99,76.62 19.08,76.71
  Top 0.406: v25.94,5.59 25.94,4.83 25.43,5.08 25.81,5.08 v25.43,5.34 | 25.86,4.86 25.89,4.83 25.94,4.45
  Top 1.016: U3.4 18.99,77.47 v18.99,76.33 18.99,75.48 | 13.37,76.07 14.38,75.06 18.57,75.06 18.99,75.48 | 13.37,76.07 13.84,76.58 C2.1 | 13.37,76.07 13.62,76.07 14.26,76.71 D3.+ 15.14,77.73 Q3.1 | R5.2 19.08,75.57 18.99,75.48
  Bottom 0.152: v39.53,35.69 40.45,35.69 40.58,34.29
  Bottom 0.305: 19.34,76.33 19.08,76.58 | 19.08,76.58 v18.99,76.33 19.08,76.67 19.08,76.58
  Bottom 1.016: v25.43,5.34 26.45,5.34 30.68,5.34 31.65,6.31 34.99,6.31 37.07,8.4 37.2,9.05 37.68,9.72 37.68,24.7 40.61,27.63 40.58,34.29 40.56,37.59 40.56,38.23 40.56,38.61 40.48,53.53 36.35,57.66 28.61,57.66 26.96,59.31 26.96,74.42 25.05,76.33 19.34,76.33
ANT
  Top 0.254: R10.1 0.79,70.99 0.79,54.61 17.43,54.61 17.43,66.04 14.13,66.04 14.13,69.72 2.06,69.72 2.06,55.75 16.16,55.75 16.16,64.77 12.86,64.77 12.86,68.45 3.46,68.45 3.46,57.02 14.76,57.02 14.76,63.37 11.46,63.37 11.46,67.06 5.11,67.06 5.11,58.17 13.37,58.17 13.37,61.98 9.81,61.98 9.81,65.53 7.14,65.53 7.14,59.95 J3.1
BOOT0  (via drill 0.3)
  Top 0.152: 25.33,28.18 25.33,28.35 v26.07,29.08 | v30.64,35.69 30.64,38.23 31.02,38.61 U2.44 32.8,38.61 33.75,39.56 33.75,39.86 R9.2
  Top 0.203: 25.33,28.18 25.33,16.62 18.87,10.16 17.18,10.16 16.45,9.43
  Top 0.305: U$4.4 16.43,9.42 16.45,9.43
  Bottom 0.152: v30.64,35.69 31.4,34.93 31.4,31.5 31.65,31.24 31.65,29.97 30.59,28.88 26.29,28.88 v26.07,29.08
BUZ
  Top 0.203: U2.43 34.32,38.1 34.7,38.48 40.7,38.48 40.95,38.23 40.95,28.58 40.06,27.69 39.15,27.69 C26.1
C_STAT
  Top 0.152: R16.1 16.44,34.47 17,33.91 18.57,33.91 19.82,32.67 24.75,32.67 25,32.92 25,33.61 U2.25
CS_LCD  (via drill 0.3)
  Top 0.305: IC1.12 21.44,91.51 v21.24,91.31
  Bottom 0.305: v21.24,91.31 U$1.P$4
CS_LORA
  Top 0.203: IC1.16 27.15,89.34 28.23,88.27 31.27,88.27 34.45,85.09 38.94,85.09 39.49,84.54 39.49,65.57 38.94,65.03 36.35,65.03 36.23,65.15
  Top 0.305: U$2.A5 36.35,65.03
D+
  Top 0.152: U2.33 28.96,32.47 28.14,31.65 R3.1 27.74,30.34 27.74,28.12 26.73,27.1 26.73,11.53 27.82,10.44 R1.2
D-
  Top 0.152: R2.2 26.42,27.27 27.41,28.26 27.41,31.47 28.48,32.51 U2.32
D_E_LCD  (via drill 0.35)
  Top 0.203: IC1.17 27.65,90.11 v28.1,89.66
  Bottom 0.203: U$1.P$5 20.06,91.53 20.48,91.95 21.88,91.95 22.89,90.93 27.21,90.93 28.1,90.04 v28.1,89.66
ESP_B0  (via drill 0.35)
  Top 0.152: R11.2 38.64,90.01 38.64,89.03
  Top 0.203: v39.4,40.26 40.26,41.14 40.26,88.12 39.4,89.03 38.64,89.03 33.43,89.03 32.29,90.17 30.89,90.17 30.65,90.41 IC1.23 | U2.40 37.91,36.6 38.13,36.38 39.33,36.38 v39.42,36.61
  Bottom 0.203: v39.42,36.61 39.42,38.71 v39.4,40.26
ESP_RST  (via drill 0.3, 0.35)
  Top 0.152: R18.1 35.63,88.18 35.85,88.39 | C25.1 R6.1
  Top 0.203: R6.1 36.77,88.39 35.85,88.39 v34.32,88.39
  Top 0.305: IC1.9 24.46,93.01 v24.16,92.71
  Bottom 0.203: v34.32,88.39 29.75,88.39 28.99,89.16 28.99,90.81 28.35,91.44 24.54,91.44 24.16,91.82
  Bottom 0.305: 24.16,91.82 v24.16,92.71
ESP_RX  (via drill 0.3)
  Top 0.152: v34.58,39.5 35.21,38.86 | U2.21 27.16,36.6 27.23,36.68 27.31,36.68 v27.46,36.83
  Top 0.203: IC1.40 29.62,97.59 29.62,98.86 29.88,99.11 34.32,99.11 35,98.45 37.43,98.45 38.04,99.06 39.54,99.06 39.91,98.7 40.12,97.83 40.92,94.12 40.97,94.07 41.02,93.81 41.02,39.72 40.16,38.86 35.21,38.86
  Bottom 0.152: v34.58,39.5 32.05,39.51 29.5,36.83 v27.46,36.83
ESP_TX  (via drill 0.3, 0.35)
  Top 0.152: U2.22 24.38,36.09 24.43,36.14 28.08,36.14 v28.1,36.13 | 40.64,39.89 40.24,39.5 v35.46,39.5
  Top 0.203: v38.77,98.4 39.27,98.43 39.57,98.43 39.59,98.4 40.47,94.16 40.49,94.04 40.49,93.53 40.61,93.43 40.64,39.89 | v38.77,99.8 38.23,99.8 37.27,98.84 35.21,98.84 34.53,99.52 29.74,99.52 29.15,98.93 IC1.41
  Bottom 0.152: 28.03,36.13 v28.1,36.13 28.52,36.13 28.75,36.35 29.54,36.35 30.74,37.55 30.74,37.57 32.29,39.12 33.94,39.12 34.19,38.86 34.88,38.86 34.98,38.97 v35.46,39.5
  Bottom 0.203: v38.77,98.4 v38.77,99.8
GND  (via drill 0.35)  (1 unrouted)
  Top 0.152: 22.12,98.37 L1.2
  Top 0.203: U$2.B7 21.44,69.09 | U2.23 22.41,35.59 22.38,35.56 21.49,36.45 v21.49,36.58 | U2.35 29.98,34.77 30,34.8 | U2.47 31.91,40.13 30.64,40.13
  Top 0.254: 26.96,40.64 U2.8 26.96,43.39 26.91,43.43 | U2.23 23.53,35.56 24.92,35.56 | U$1.PW2A 30.15,100.18 30.26,100.08 | U2.47 32.87,40.11 33.1,40.34
  Top 0.305: ANT1.GND2 16.2,68.95 16.2,68.18 16.29,68.09 18.32,68.09 18.41,68.18 18.41,68.95 ANT1.GND1 18.73,68.96 | v23.78,69.09 23.87,69.09 23.95,69.01
  Top 0.61: C2.2 11.21,75.69 v10.7,76.33 v10.7,77.09 | C5.2 9.85,77.09 v10.7,77.09 | C4.2 11.12,77.26 10.95,77.09 v10.7,77.09 | R5.1 24.9,75.57 C9.2
  Top 0.813: v25.56,70.61 23.95,69.01 U$2.B7 19.42,69.01 18.73,68.96
  Bottom 0.152: U$3.GND 27.08,100.69 v27.08,100.33 | U$3.GND@1 24.8,100.6 v24.8,100.33
  Bottom 0.305: U$1.SPK2 22.49,96.25 v21.75,95.45
  other vias: 32.04,79.5 0.92,79.88 1.81,79.88 2.57,79.88 3.33,79.88 4.1,79.88 4.86,79.88 4.86,80.65 9.43,80.14 14.48,81.84 14.64,88.01 12.54,86.36 11.72,85.6 13.75,87.63 24.23,75.25 24.61,78.87 25.74,72.14 24.92,72.14 28.35,72.01 28.48,69.85 25.56,69.85 25.69,68.07 22.14,78.89 26,77.41 19.97,79 20.35,82.93 21.24,82.93 22.13,82.93 27.97,82.81 28.73,82.81 29.62,82.81 30.39,82.81 26.58,87.5 32.29,89.16 33.05,94.24 20.99,95.63 29.14,92.78 28.38,92.78 27.62,92.78 26.85,92.78 27.34,96.59 27.21,95.76 29.12,96.59 29.12,95.82 29.94,95.82 25.56,100.33 26.32,100.33 37.62,100.2 34.7,100.2 33.94,100.2 33.18,100.2 32.42,100.2 31.66,100.2 30.89,100.2 30.13,100.2 29.37,100.2 28.61,100.2 27.85,100.33 19.59,100.2 18.83,100.2 18.07,100.2 17.3,100.2 16.54,100.2 15.78,100.2 15.02,100.2 14.26,100.2 13.49,100.2 12.73,100.2 11.97,100.2 11.21,100.2 10.45,100.2 9.68,100.2 8.92,100.2 8.16,100.2 7.4,100.2 6.64,100.2 5.87,100.2 5.11,100.2 4.35,100.2 3.59,100.2 2.83,100.2 2.06,100.08 20.35,96.14 23.91,85.6 16.8,85.73 16.29,84.96 15.78,90.81 17.43,94.74 34.32,72.26 38.77,72.14 38.89,64.01 36.1,54.87 33.81,56.01 27.21,57.02 32.29,50.42 34.58,50.29 38.41,54 26.32,54.87 26.19,58.17 28.48,61.22 28.48,64.26 25.69,63.76 25.69,66.04 0.92,43.56 15.15,26.04 10.88,37.85 15.02,32.13 14.64,22.99 23.91,29.08 22.38,29.08 23.78,20.45 16.8,16.13 29.12,22.99 27.46,22.99 29.92,14.53 36.1,23.12 38.89,22.1 37.62,26.29 5.44,40.29 0.92,40.01 0.92,32.01 2.32,21.72 16.8,11.81 8.8,3.05 18.19,2.54 21.5,4.7 21.62,2.54 33.56,1.65 36.48,5.84 29.98,38.33 33.26,30.99 35.85,40.39 25.94,37.29 25.56,35.43 12.99,37.64 18.7,39.37 10.45,39.37 17.94,41.28 18.19,43.18 26.8,39.5 26.83,40.77 39.02,43.69 39.15,48.52 35.72,48.39 35.85,41.91 37.24,40.39 39.15,33.15 20.86,20.7 17.05,19.18 11.34,18.04 16.92,22.73 11.46,24.51 10.57,23.12 10.7,28.7 1.46,25.81 8.64,42.7 33.18,13.97 27.46,19.05 36.23,29.08 39.28,16.38 29.5,11.05 39.02,14.35 24.57,13.72 24.42,8 23.02,3.3 22.77,11.69 11.97,10.8 14,17.78 14.13,16.13 9.3,13.97 10.19,6.86 8.92,5.21 4.48,22.1 28.1,40.77 27.72,38.1 30.51,39.75 31.27,41.4 32.04,31.88 24.14,33.35 17.81,28.96 14.64,24.77 11.21,15.37 17.43,26.04 29.37,19.05 17.3,14.1 5.75,30.1 5.11,37.72 5.49,28.96 10.07,32.51 10.7,34.42 5.11,42.8 5.49,84.08 14.89,90.81 4.48,82.17 6.76,84.08 14.18,84.15 21.88,80.39 38.77,79.38 30.72,81.46 34.2,79.88 34.32,74.17 34.96,85.98 32.93,87.63 39.91,89.66 38.51,84.2 20.35,92.71 37.92,96.48 33.05,95 4.22,27.69 0.92,30.1 4.48,20.32 4.48,21.21 4.48,22.99 4.48,23.88 26.09,92.78 29.9,92.78 35.53,86.87 26.47,92.08 27.24,92.08 28,92.08 28.76,92.08 29.52,92.08 30.28,92.08 30.66,92.8 28.42,94.49 29.94,96.59 26.51,95.38 26.07,96.01 26.58,96.6 29.94,95.06 29.43,94.49 28.95,95.06 33.05,91.82 33.05,91.06 38.51,92.08 33.81,94.24 35.62,94.65 35.72,92.01 39.28,96.52 39.85,93.41 10.7,84.46 34.32,89.79 39.37,28.98 29.43,24.32 35.4,21.72 30.58,12.7 23.78,26.54 30.51,50.95 30.26,54.87 32.04,54.87 29.93,58.9 28.99,59.56 28.35,54.87 31.2,64.52 31.27,74.42 29.12,74.68 28.48,67.82 29.12,76.07 34.2,77.34 32.04,77.22 26.96,78.11 14.21,82.58 22.51,95.43 23.27,95.51 3.08,14.99 12.48,84.84 14.18,83.36 38.39,42.29 38.01,29.08 18.5,11.81 32.93,41.53 35.72,81.03 30.89,86.23 34.07,86.74 1.81,99.19 1.3,96.52 1.18,95.76 1.05,95 0.92,94.24 0.92,93.47 0.92,92.71 35.34,99.7 4.96,5.83 4.48,11.05 9.68,15.11 4.22,16 1.68,20.19 30.39,16.87 30.51,7.75 32.04,4.95 18.07,37.85 11.97,9.65 10.32,5.46 19.21,3.18 28.61,47.92 26.63,50.5 26.31,48.39 28.82,46.51 26.32,44.31 33.81,95 37.24,97.16 33.05,93.35 33.05,92.58 10.66,88.28 8.96,86.58 8.16,86.58 7.36,86.58 6.46,86.58 6.76,90.38 9.66,90.38 32.97,29.68 29.67,29.58 28.58,50.67 38.74,58.02 29.22,21.57 24.26,31.98
  pour Bottom (isolate 0.152, rank 6): -0.09,100.46 41.69,100.46 40.8,0 -0.98,0
  pour Bottom (isolate 0.203, rank 5): -0.09,100.46 41.69,100.46 41.82,0 0.03,0
  pour Top (isolate 0.203, rank 5): 41.56,100.46 -0.22,100.46 0.03,0 41.82,0
IO5
  Top 0.152: IC1.34 32.17,96.01 32.42,95.76 34.68,95.76 35.06,95.38 36.1,95.38 TP1.P$1
IO18
  Top 0.152: IC1.35 32.43,96.51 32.75,96.22 | 32.75,96.22 32.77,96.19 TP2.P$1 | 32.75,96.22 32.52,96.45
KP  (via drill 0.35)  (1 unrouted)
  Top 0.152: U2.10 25.97,42.93 25.76,43.13 25.04,43.13 24.64,43.53 24.64,48.23 v25.56,49.07
  Top 0.2: v39.22,59.64 39.52,59.42 39.52,50.39 v39.2,50.02
  Top 0.203: U$1.PW1A 34.31,106.06 34.46,105.91 34.48,105.66 34.48,104.36 35.34,103.5 35.34,100.71 v36.58,99.47 | U2.10 25.94,42.09
  Bottom 0.203: v36.58,99.47 37.75,98.3 37.75,97.66 38.13,97.28 39.78,97.28 40.29,96.78 40.67,94.81 40.67,93.85 41.02,93.51 41.02,61.43 39.27,59.69 v39.22,59.64 | v39.2,50.02 38.58,49.4 26.07,49.4 25.56,48.9 v25.56,49.07
KX1  (via drill 0.3, 0.35)
  Top 0.152: v20.61,31.37 20.61,28.7 v20.73,28.45 | v35.59,30.35 35.59,32.26 | 35.59,32.26 v35.59,33.53 | U2.11 25.46,40.49 v25.81,40.13 | v33.31,44.32 v36.57,44.32 | v37.92,32.22 35.63,32.22 35.59,32.26
  Top 0.203: v7.27,33.53 18.32,33.53 v20.61,31.37
  Bottom 0.152: U$1.B3I 6.57,33.34 v7.27,33.53 | U$1.B2I 20.62,31.39 v20.61,31.37 | U$1.B1I 34.83,34.2 v35.59,33.53 | U$1.BCI 32.97,44.37 v33.31,44.32 | v35.59,30.35 32.54,30.35 30.74,28.56 29.74,28.56 29.63,28.45 v20.73,28.45 | v36.57,44.32 36.57,41.02 | 36.57,41.02 36.57,40.51 | 36.57,40.51 36.57,37.86 | 36.57,40.51 | v25.81,40.13 28.21,40.13 28.43,39.91 29.65,39.91 30.51,40.77 35.21,40.77 35.46,41.02 36.57,41.02
  Bottom 0.203: 36.57,37.86 36.57,37.34 37.06,36.86 36.96,36.98 38.3,35.64 38.3,32.99 37.92,32.61 v37.92,32.22
KX2  (via drill 0.3)
  Top 0.152: v21.11,48.13 21.11,42.29 20.86,42.04 v20.99,41.91 24.82,41.91 U2.12 | v23.68,22.23 23.65,22.35 21.49,22.35 v20.1,23.75 v16.7,23.75 10.95,23.75 10.57,24.13 10.57,25.4 10.06,25.91 v8.79,25.91 | v33.69,22.23 33.56,22.35 v33.56,25.02
  Bottom 0.152: U$1.B6I 7.91,25.91 v8.79,25.91 | U$1.B5I 20.13,23.75 v20.1,23.75 | U$1.B4I v33.56,25.02 | U$1.BMI 20.61,49.03 v21.11,48.13 | v20.99,41.91 20.99,38.1 16.67,33.78 16.67,23.99 16.7,23.86 v16.7,23.75 | v23.68,22.23 v33.69,22.23
KX3  (via drill 0.3, 0.35)
  Top 0.152: v8.88,41.28 9.21,41.15 v13.62,41.15 14.18,40.59 U2.13 | v3.59,19.56 4.58,18.57 4.58,17.43 4.98,17.02 4.98,14.48 5.87,13.59 7.14,13.59 7.65,14.1 v7.65,17.15 | 22.89,18.29 v23.83,18.29 23.91,18.29 | v30.13,18.29 v32.92,18.29
  Top 0.203: v7.65,17.15 10.95,17.15 v11.21,16.89 | v22.26,20.07 22.26,18.92 22.89,18.29 20.99,16.38 v19.84,16.38
  Bottom 0.152: U$1.B9I v7.65,17.15 | U$1.B8I 20.73,16.38 v19.84,16.38 | U$1.B7I 32.97,18.24 v32.92,18.29 | U$1.BDI 13.62,41.74 v13.62,41.15 | v8.88,41.28 4.73,41.28 4.4,40.95 4.4,38.23 2.48,36.31 2.48,26.05 3.77,24.77 3.77,20.83 3.59,20.65 v3.59,19.56 | v23.83,18.29 v30.13,18.29
  Bottom 0.203: v11.21,16.89 15.91,16.89 18.95,19.94 22.26,19.94 v22.26,20.07
KX4  (via drill 0.3, 0.35)
  Top 0.152: v33.31,9.15 33.31,7.37 32.92,6.99 v29.5,6.99 | v6.38,46.1 4.72,44.46 | 4.72,44.46 v4.1,43.82 | U2.14 8.97,40.11 4.72,44.46
  Top 0.2: v8.29,9.27 5.74,6.73 v5.74,6.53
  Top 0.203: v20.61,7.49 21.11,6.99 v25.18,6.99
  Bottom 0.152: U$1.BSI 8.29,10.03 v8.29,9.27 8.29,9.15 | U$1.B0I 20.61,8.28 v20.61,7.49 | U$1.BAI 33.32,9.26 33.43,9.15 v33.31,9.15 | v29.5,6.99 v25.18,6.99 | U$1.BUI 6.92,46.64 v6.38,46.1 | v4.1,43.82 4.1,38.36 2.17,36.43 2.17,25.8 3.46,24.51 3.46,20.96 1.81,19.31 1.81,16.47 1.85,16.44 1.85,16.05 2,15 2.2,13.58 2.34,12.61 2.6,12.35 2.6,11.15 3.59,10.16 3.71,10.16 3.97,9.91
  Bottom 0.2: v5.74,6.53 5.89,6.68 6.06,6.68
  Bottom 0.203: 3.97,9.91 4.35,9.15 4.35,8.38 6.06,6.68 6.51,6.22 17.3,6.22 19.56,3.97 22.16,3.97 v25.18,6.99
KY1  (via drill 0.3)
  Top 0.152: 24.52,39.6 24.72,39.4 24.72,38.93 25.14,38.51 25.93,38.51 26.27,38.19 v26.24,38.2 | U2.15 24.52,39.6 | 24.52,39.6 24.49,39.63
  Bottom 0.152: U$1.BAO 36.12,10.64 U$1.B7O 35.72,18.6 35.72,19.69 34.58,20.83 34.32,20.83 34.32,23.62 35.87,25.17 U$1.B4O 37.17,27.19 U$1.B1O 37.17,34.87 36.16,35.88 | 36.16,35.88 36.1,35.94 33.43,35.94 33.31,36.07 32.42,36.07 32.16,36.32 29.96,36.32 29.68,36.04 28.89,36.04 28.38,35.54 27.62,35.54 26.83,36.32 26.83,37.59 v26.24,38.2 | 36.23,35.94 36.16,35.88
KY2  (via drill 0.3)
  Top 0.152: v22,39.12 23.48,39.12 U2.16
  Bottom 0.152: U$1.B8O U$1.B5O 22.51,24.9 22.51,25.91 22,26.42 19.21,26.42 18.95,26.67 18.95,30.1 21.08,30.1 23.07,32.09 U$1.B2O 22.92,38.45 22.26,39.12 v22,39.12
  Bottom 0.203: U$1.B8O 23.07,15.93 20.99,13.84 18.35,13.84 17.84,13.34 17.84,10.62 18.32,10.16 19.59,10.16 19.97,10.54 21.88,10.54 23.15,9.27 23.15,8.47 U$1.B0O
KY3  (via drill 0.3)
  Top 0.152: U2.17 22.44,38.61 22.37,38.54 21.63,38.54 21.56,38.61 10.19,38.61 9.43,37.85 v9.43,37.72
  Bottom 0.152: 10.19,26.04 10.19,27.05 8.87,28.37 U$1.B3O 9.43,34.7 v9.43,37.72 | 10.19,26.04 10.19,25.91 U$1.B6O | U$1.BSO 10.42,17.69 U$1.B9O 9.92,25.77 10.19,26.04
KY4  (via drill 0.3)
  Top 0.152: U2.29 v26.96,35.18
  Bottom 0.152: U$1.BUO 12.22,46.74 16.29,42.67 16.22,42.61 U$1.BDO 19.8,41.99 21.24,43.44 | U$1.BMO 22.97,47.13 | 22.97,47.13 22.97,45.17 | 21.24,43.44 22.97,45.17 | U$1.BCO 35.27,44.2 | 35.27,44.2 35.27,44.13 | 21.24,43.44 22.38,42.29 22.38,40.13 23.4,39.12 23.4,35.82 24.42,34.8 26.32,34.8 26.7,35.18 v26.96,35.18 | 35.27,44.2 34.13,43.05 32.54,43.05 30.38,45.21 30.38,46.8 30.71,47.13 22.97,47.13 | 23.02,45.21 22.97,45.17
LED
  Top 0.152: U2.46 33.03,39.6 33.69,40.26 33.69,43.05 34.19,43.56 36.86,43.56 37.24,43.94 37.24,45.59 Q4.1
MISO
  Top 0.203: IC1.14 26.15,89.2 27.84,87.5 30.77,87.5 32.8,85.47 32.8,63.76 31.78,62.74 31.78,59.44 32.29,58.93 36.28,58.93 U$2.A2
MOSI  (via drill 0.35)
  Top 0.203: v33.33,96.88 33.16,97.01 IC1.36 | 36.35,60.83 v32.8,60.83
  Top 0.305: U$2.A3 36.36,60.84 36.35,60.83
  Bottom 0.203: v33.33,96.88 29.9,93.45 20.12,93.45 19.21,92.58 19.21,88.41 U$1.P$6 18.9,82.99 19.97,81.92 27.97,81.92 30.51,79.38 30.51,62.1 31.78,60.83 v32.8,60.83
MOT  (via drill 0.35)
  Top 0.203: 22.89,27.56 v23.02,27.69 22.64,27.69 22,27.05 17.18,27.05 R17.2 Q2.1 | v30.2,27.86 31.71,27.87 32.04,28.2 40.04,28.2 40.54,28.7 40.54,37.85 40.29,38.1 34.96,38.1 34.45,37.59 U2.42
  Bottom 0.203: v23.02,27.69 30,27.69 v30.2,27.86
N$1  (via drill 0.35)
  Top 0.305: v23.7,90.3 23.7,89.41 C1.2
  Bottom 0.305: U$1.P$2 23.55,90.35 v23.7,90.3
N$2  (via drill 0.3)
  Top 0.457: v23.81,100.48 23.79,100.04 C16.1 23.82,98.35 C17.1
  Bottom 0.457: U$3.FEED 23.85,100.37 v23.81,100.48
N$3
  Top 0.33: IC1.2 23.92,96.51
  Top 0.356: 23.92,96.51 C17.2 23.83,96.54 L1.1
N$4
  Top 0.203: R10.2 13.85,71.01 17.19,71.01
  Top 0.254: 17.19,71.01 U$2.B8 | R10.2
  Top 0.305: ANT1.D 17.19,70.98 17.19,71.01
N$5
  Top 0.203: J1.D+ 27.59,8.28 R1.1
N$6
  Top 0.203: J1.D- 26.94,7.99 R2.1
N$7  (via drill 0.35)
  Top 0.152: U3.1 21.46,79.63 26.42,79.63 29.98,76.07 31.6,76.07 31.91,75.77 31.91,64.21 30.66,62.97 30.66,56.67 30,56.01 v25.71,56.01 | v14.31,46.31 10.27,42.27 v10.14,42.52 | v12,34.44 13.14,34.44 R16.2
  Bottom 0.152: v25.71,56.01 24.64,56.01 23.12,54.48 14.56,54.48 13.11,53.04 13.11,47.6 14.31,46.41 v14.31,46.31 | v10.14,42.52 10.14,40.59 12,38.74 v12,34.44
N$8
  Top 0.203: C26.2 R19.1 33,27.46 32.59,27.05 Q1.1
N$9
  Top 0.61: 37.36,19.44 37.37,19.43 37.5,19.43 37.47,19.46 U$1.BUZ1
  Top 1.016: D1.+ 30.18,20.45 Q1.3 34.22,19.46 U$1.BUZ1
N$10
  Top 0.152: U2.5 28.48,43.44 29.76,44.72 Y1.3 29.76,46.68 30.91,47.83 C13.2
N$11
  Top 0.203: U$1.BTEMP 26.04,84.3 24.92,83.19 TP4.P$1
N$12
  Top 0.305: D2.+ 8.34,29.85 8.35,29.85
  Top 0.508: Q2.3 8.6,30.1 8.35,29.85 8.03,29.85 | D2.+ 8.67,30.1 6.76,28.2 6.76,25.4 8.41,23.75
  Top 0.813: U$1.MOT1 8.41,20.93 8.41,23.75
N$13
  Top 0.508: U3.5 20.99,77.73 R4.2
N$14  (via drill 0.3)
  Top 0.305: 11.65,79.02 C4.1
  Top 0.813: 9.75,79.06 9.85,78.96 | 9.94,78.87 9.85,78.96 | 9.85,78.96 C5.1
  Top 1.016: Q3.2 17.62,78.55 | 17.62,78.55 17.56,78.61 v17.94,78.61 | C4.1 10.87,78.83 arc154 v10.7,79 10.53,78.96 C5.1 | D3.- 17.43,78.37 17.62,78.55
  Top 1.27: v10.7,79 10.7,82.4 | 10.7,82.4 U$6.3 | C23.+ 10.73,82.81 10.7,82.4
  Bottom 1.016: v17.94,78.61 11.08,78.61 v10.7,79
N$15
  Top 0.152: 27.56,48.58 27.61,48.53 27.61,47.25 27.61,46.73 28.31,46.03 28.31,43.93 27.97,43.59 U2.6 | 27.56,48.58 Y1.1 | 27.56,48.58 27.56,48.68 27.85,48.97
  Top 0.203: C12.2 27.6,47.26 27.61,47.25
N$16  (via drill 0.3)
  Top 0.152: v15.14,17.65 15.14,16.89 15.02,16.77 15.02,11.56 12.43,8.97 U$4.8 | v19.21,37.85 19.46,38.1 U2.18
  Bottom 0.152: v15.14,17.65 15.14,19.31 15.73,19.94 15.73,24.91 15.98,25.16 15.98,34.05 19.21,37.28 v19.21,37.85
N$17  (via drill 0.3)
  Top 0.203: v20.73,98.68 20.22,98.17 TP6.P$1
  Bottom 0.203: U$1.SPK1 v20.73,98.68
N$19  (via drill 0.35)
  Top 0.203: U2.41 38.29,37.09 v38.51,37.24 | v38.51,40.99 38.54,41.02 39.4,41.02 39.9,41.52 39.87,87.74 39.5,88.11 R6.2
  Bottom 0.203: v38.51,37.24 v38.51,40.99
N$21
  Top 0.203: U$1.B_SI 23.02,84 TP5.P$1
N$23  (via drill 0.35)
  Top 0.203: 23.53,52.83 23.1,52.83
  Top 0.305: D6.C 23.27,52.7 23.1,52.83
  Top 0.61: Q4.3 37.62,51.84 D7.C 37.86,53.16 37.25,53.77 24.03,53.77 23.1,52.83 | D4.C D5.C 14.66,52.73 v14.66,53.22 | v22.46,52.83 23.1,52.83 | 23.1,52.83 23.4,52.83
  Bottom 0.61: v14.66,53.22 15.19,53.74 17.76,53.75 18.7,52.83 v22.46,52.83
N$24  (via drill 0.35)
  Top 0.152: D5.A 17.91,51.82 17.94,51.82
  Top 0.305: D5.A 18.06,51.88
  Top 0.406: v19.66,53.77 19.66,52.28 19.27,51.88 18.06,51.88 18.06,51.87
  Top 0.61: D7.A v27.87,51.88 D6.A | D4.A 3.42,50.65 4.29,49.79 16.92,49.79 17.49,50.36 | 17.94,51.82 17.94,50.8 17.49,50.36 | R7.1 17.66,50.36 17.49,50.36
  Bottom 0.61: v19.66,53.77 26.17,53.77 27.87,52.07 v27.87,51.88
N$25
  pour Top (isolate 4.572, rank 2): 0.03,74.04 20.23,74.17 20.23,49.66 -0.09,49.66
  cutout Bottom (isolate 5.08, rank 4, no thermals): 23.65,75.95 -0.09,76.07 0.1,45.79 23.97,45.79
N$26  (via drill 0.35)
  Top 0.152: R12.1 R13.2 28.26,78.96 28.35,78.87 28.3,79.02 28.3,79.11 C22.1 28.37,78.19 30.11,76.46 31.78,76.46 32.29,75.95 32.29,64.01 31.15,62.87 v31.15,56.01 | v24.92,37.59 U2.19 | v24.82,49.81 24.31,49.32 24.31,42.83 24.12,42.64 v24.12,42.56
  Bottom 0.152: v31.15,56.01 31.15,50.29 30.64,49.79 24.77,49.79 v24.82,49.81 | v24.12,42.56 24.12,39.82 24.92,39.02 v24.92,37.59
NRST  (via drill 0.3)
  Top 0.152: U2.7 27.46,39.22 27.08,38.84 25.3,38.84 25.05,39.09 25.05,40.64 24.42,41.28 v20.22,41.28 | v16.03,18.92 16.03,17.15 15.4,16.51 15.4,11.18 13.43,9.21 U$4.7
  Top 0.203: R8.1 19.59,41.53 19.84,41.28 v20.22,41.28
  Bottom 0.152: v20.22,41.28 20.22,37.85 16.29,33.91 16.29,25.02 16.03,24.77 v16.03,18.92
RES_LCD  (via drill 0.3)
  Top 0.305: v25.05,90.3 25.65,90.9 IC1.13
  Bottom 0.305: U$1.P$1 25.04,90.28 v25.05,90.3
RST_LORA
  Top 0.203: IC1.15 26.65,89.2 27.97,87.89 31.02,87.89 33.31,85.6 33.31,67.57 33.94,66.93 36.28,66.93 U$2.A6
S_RX
  Top 0.203: 18.45,9.02 18.75,9.32 19.12,9.32 26.07,16.27 26.09,27.45 27.08,28.44 27.08,31.85 27.97,32.77 U2.31
  Top 0.305: U$4.2 18.43,9 18.45,9.02
S_TX
  Top 0.203: U2.30 27.46,32.77 26.7,32.01 26.7,28.57 25.71,27.58 25.71,16.48 18.93,9.7 18.17,9.7 17.45,9.03
  Top 0.305: U$4.3 17.43,9.02 17.45,9.03
SCLK  (via drill 0.35)
  Top 0.152: U$2.A4 35.83,63.01 35.72,63.12
  Top 0.203: v30.64,98.43 30.64,97.58 IC1.38 | v33.69,62.99 33.81,63.12 35.72,63.12
  Bottom 0.203: v30.64,98.43 30.64,94.74 30.66,94.72 29.74,93.8 19.94,93.8 18.83,92.72 18.83,90.73 18.68,90.55 18.57,90.55 18.07,90.04 18.07,89.79 17.73,89.45 U$1.P$7 17.73,83.53 19.84,81.41 27.72,81.41 30,79.12 30,61.22 31.4,59.82 33.31,59.82 33.69,60.2 v33.69,62.99
SWCLK  (via drill 0.3)
  Top 0.203: 15.45,9.57 16.41,10.54 18.74,10.54 24.92,16.73 24.92,29.76 25.43,30.27 v25.43,31.12 | v30.95,30.86 32.16,30.86 32.8,31.5 32.8,34.8 32.49,35.1 U2.37
  Top 0.305: U$4.5 15.43,9.56 15.45,9.57
  Bottom 0.152: v30.95,30.86 30.69,31.12 v25.43,31.12
SWDIO  (via drill 0.3)
  Top 0.203: 14.45,9.59 15.75,10.9 18.57,10.9 24.57,16.89 24.57,30.45 v24.51,30.45 | U2.34 29.47,32.31 v29.52,32.26
  Top 0.305: U$4.6 14.45,4.92 14.45,9.59
  Bottom 0.254: v29.52,32.26 29.01,31.75 25.05,31.75 25.08,31.75 24.52,31.19 24.52,30.86 v24.51,30.45
USB_PRES
  Top 0.152: R14.1 R15.2 33.24,36.09 U2.39
VBAT  (via drill 0.35)
  Top 0.152: R12.2 v24.42,80.65 | 18.45,80.14 18.19,80.39 18.19,80.52 v18.19,81.41
  Top 0.508: U3.3 18.48,80.17 18.45,80.14
  Top 1.27: U$1.BATT+ 18.45,84.51 18.45,80.14 | C3.1 15.78,80.27 Q3.3 18.19,80.52
  Bottom 0.152: v24.42,80.65 24.29,80.65 23.91,81.03 18.57,81.03 v18.19,81.41
(copper drawn outside any net)
  shapes: Top circle x3

### Text on the board
tNames: 1337 3310 WiFi | Mastro Gippo | EM <3 | - | + | v0.3 2018-07-10 | IHC badge | +3.3 | B0 | nrst | swdio | swclk | boot0 | tx | rx